# EAGLE schematic Main Schematic ScamAway (EAGLE 9.2.1)
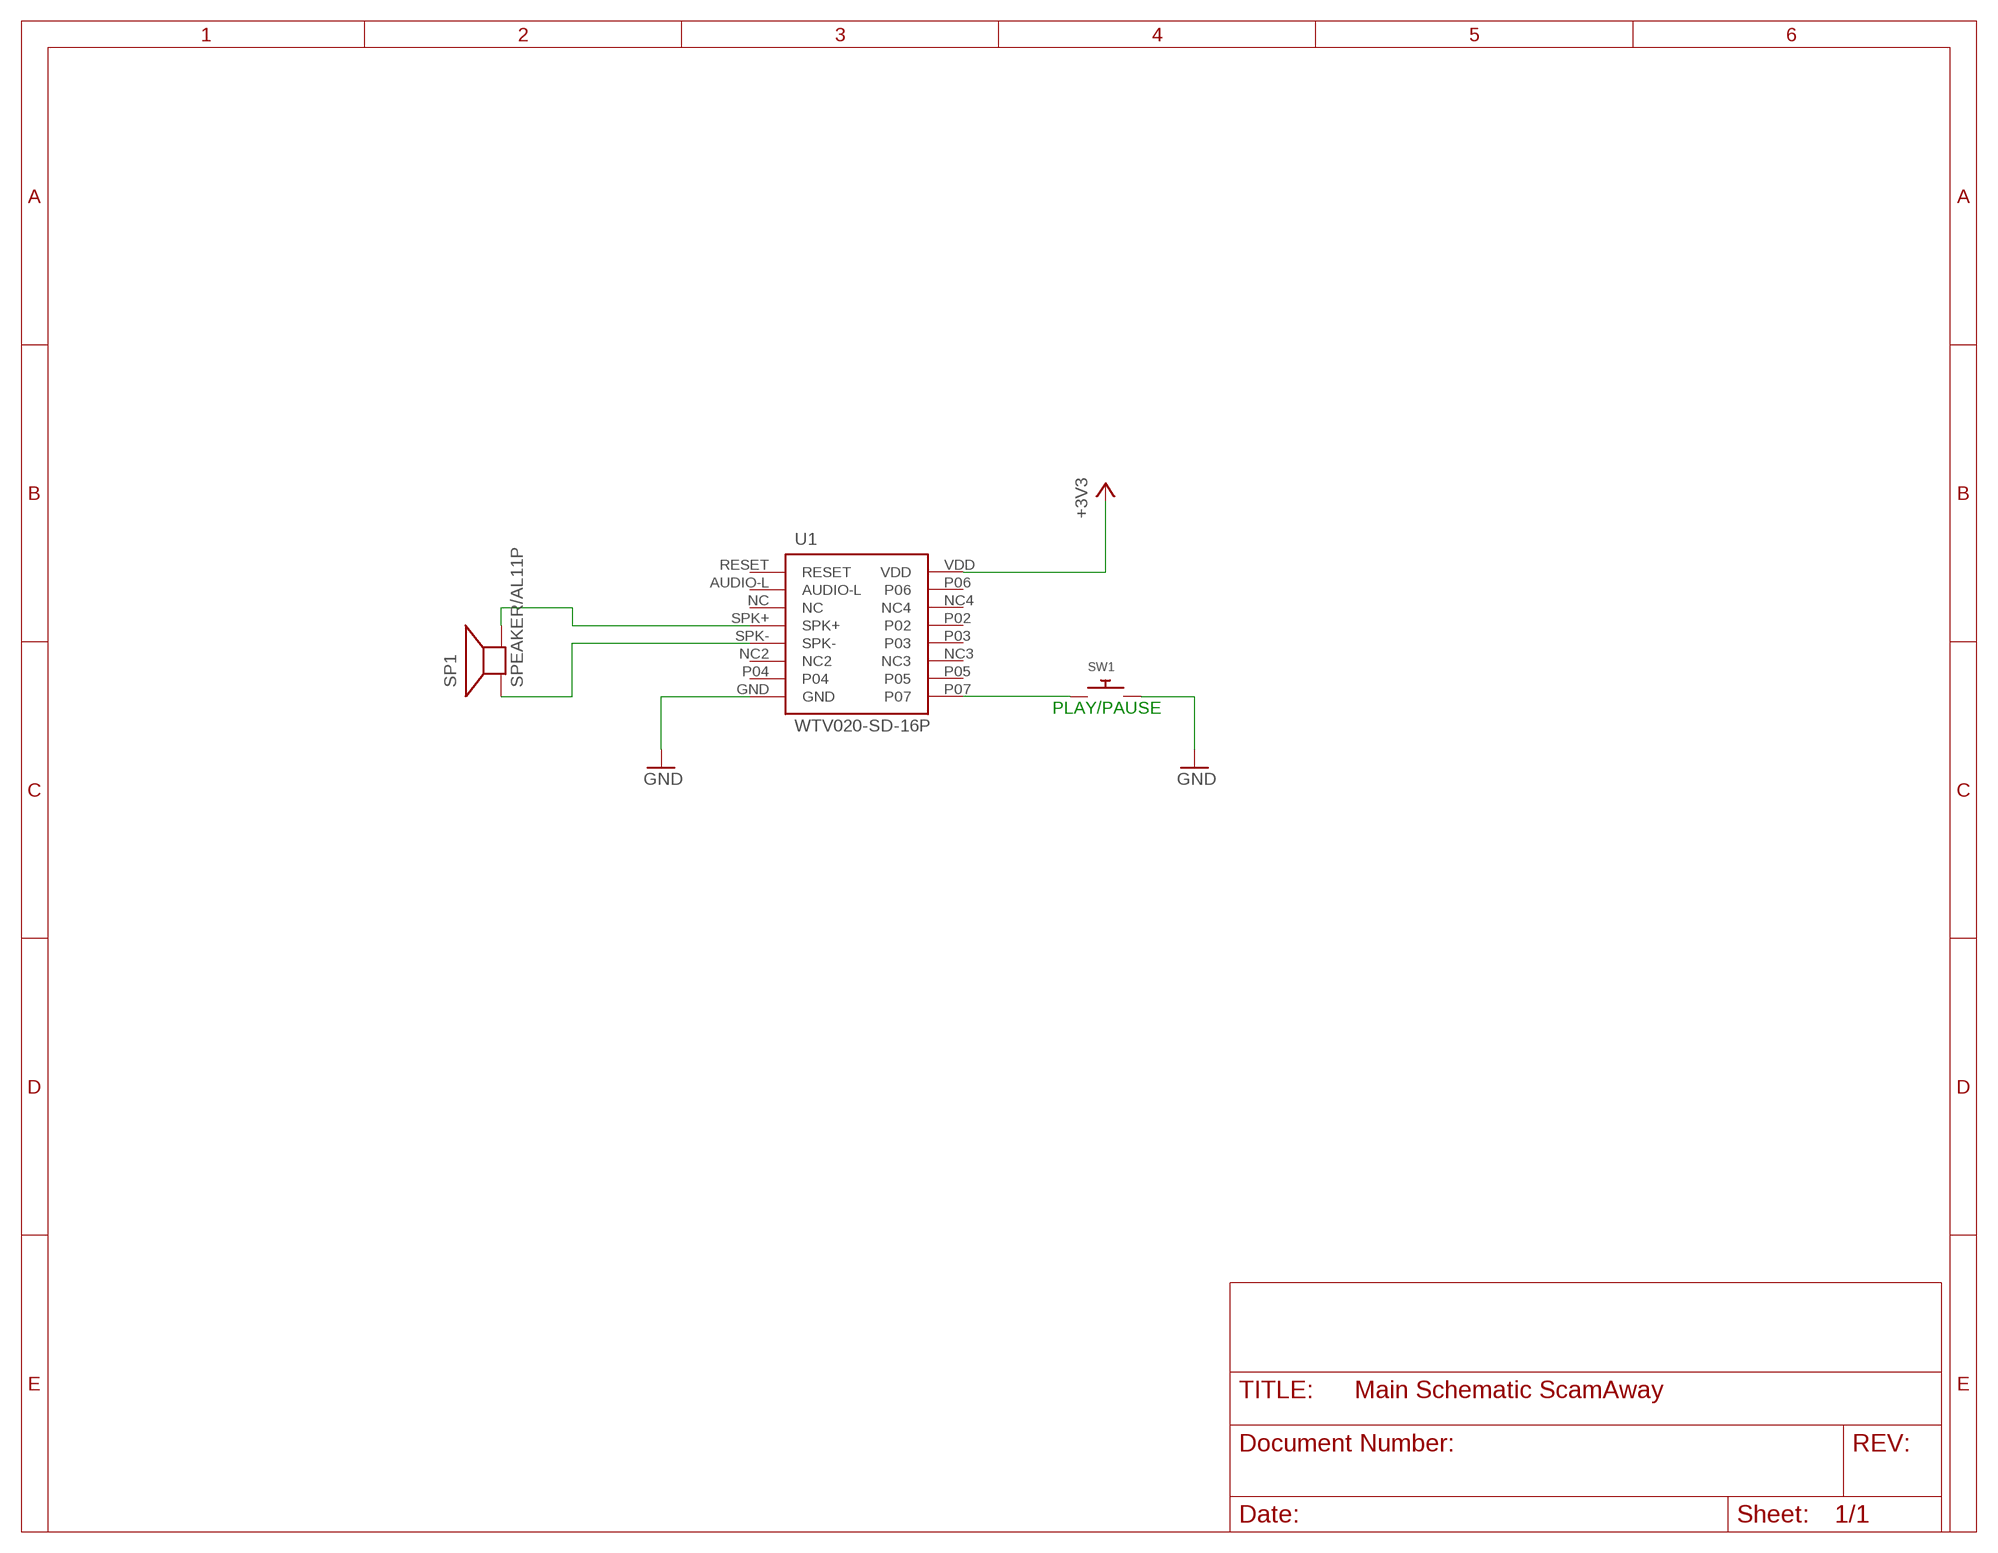
[diagram p0: schematic, sheet 1]

## Parts
SP1  SPEAKER/AL11P  [AL11P]
SW1  SWITCH_PUSHBUTTONSOFTTOUCHSMD_SJ  [PUSHBUTTON_SMD_SJ]
U1  WTV020-SD-16P  [DIP16]

## Nets
+3V3: U1.VDD
GND: SW1.P$2 U1.GND
N$1: SP1.+ U1.SPK-
N$2: SP1.- U1.SPK+
N$3: SW1.P$1 U1.P07
Unconnected: U1.AUDIO-L U1.NC U1.NC2 U1.NC3 U1.NC4 U1.P02 U1.P03 U1.P04 U1.P05 U1.P06 U1.RESET

## Notes on the sheet
- PLAY/PAUSE

## Library data of the parts
SP1 = adafruit:SPEAKER: SPEAKER Source: Buerklin Added PS12 (for part # PS1240 piezo) http://www.ladyada.net/library/pcb/eaglelibrary.html
SW1 = adafruit:SWITCH_PUSHBUTTON: Buttons SOFTTOUCHSMD_SJ - Soft touch temporary push button (Super Junk Akihabara) Compatible with SKPMANE010 [Mouser: 688-SKPMAN] C&K_KSS = Digikey: KSS221GLFS
U1 = Youtube:WTV020-SD-16P